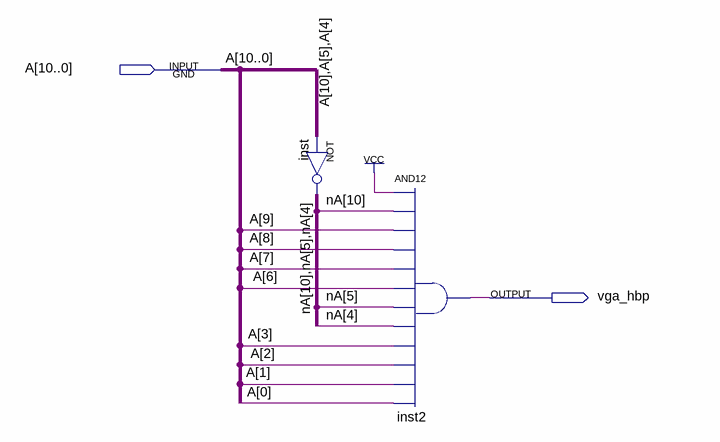
[diagram p0: schematic sheet]
// Quartus schematic vga_hbp.bdf as structural Verilog: 2 symbols, 2 pins
module vga_hbp (
  input  [10:0] A,
  output vga_hbp
);

  wire [10:4] nA;

  assign {nA[10], nA[5:4]} = ~{A[10], A[5:4]};  // NOT inst, 3 bits wide
  and inst2 (vga_hbp, 1'b1, nA[10], A[9], A[8], A[7], A[6], nA[5], nA[4], A[3], A[2], A[1], A[0]);
endmodule
